# EAGLE design electromyography_3_channels (EAGLE 8.4.1)
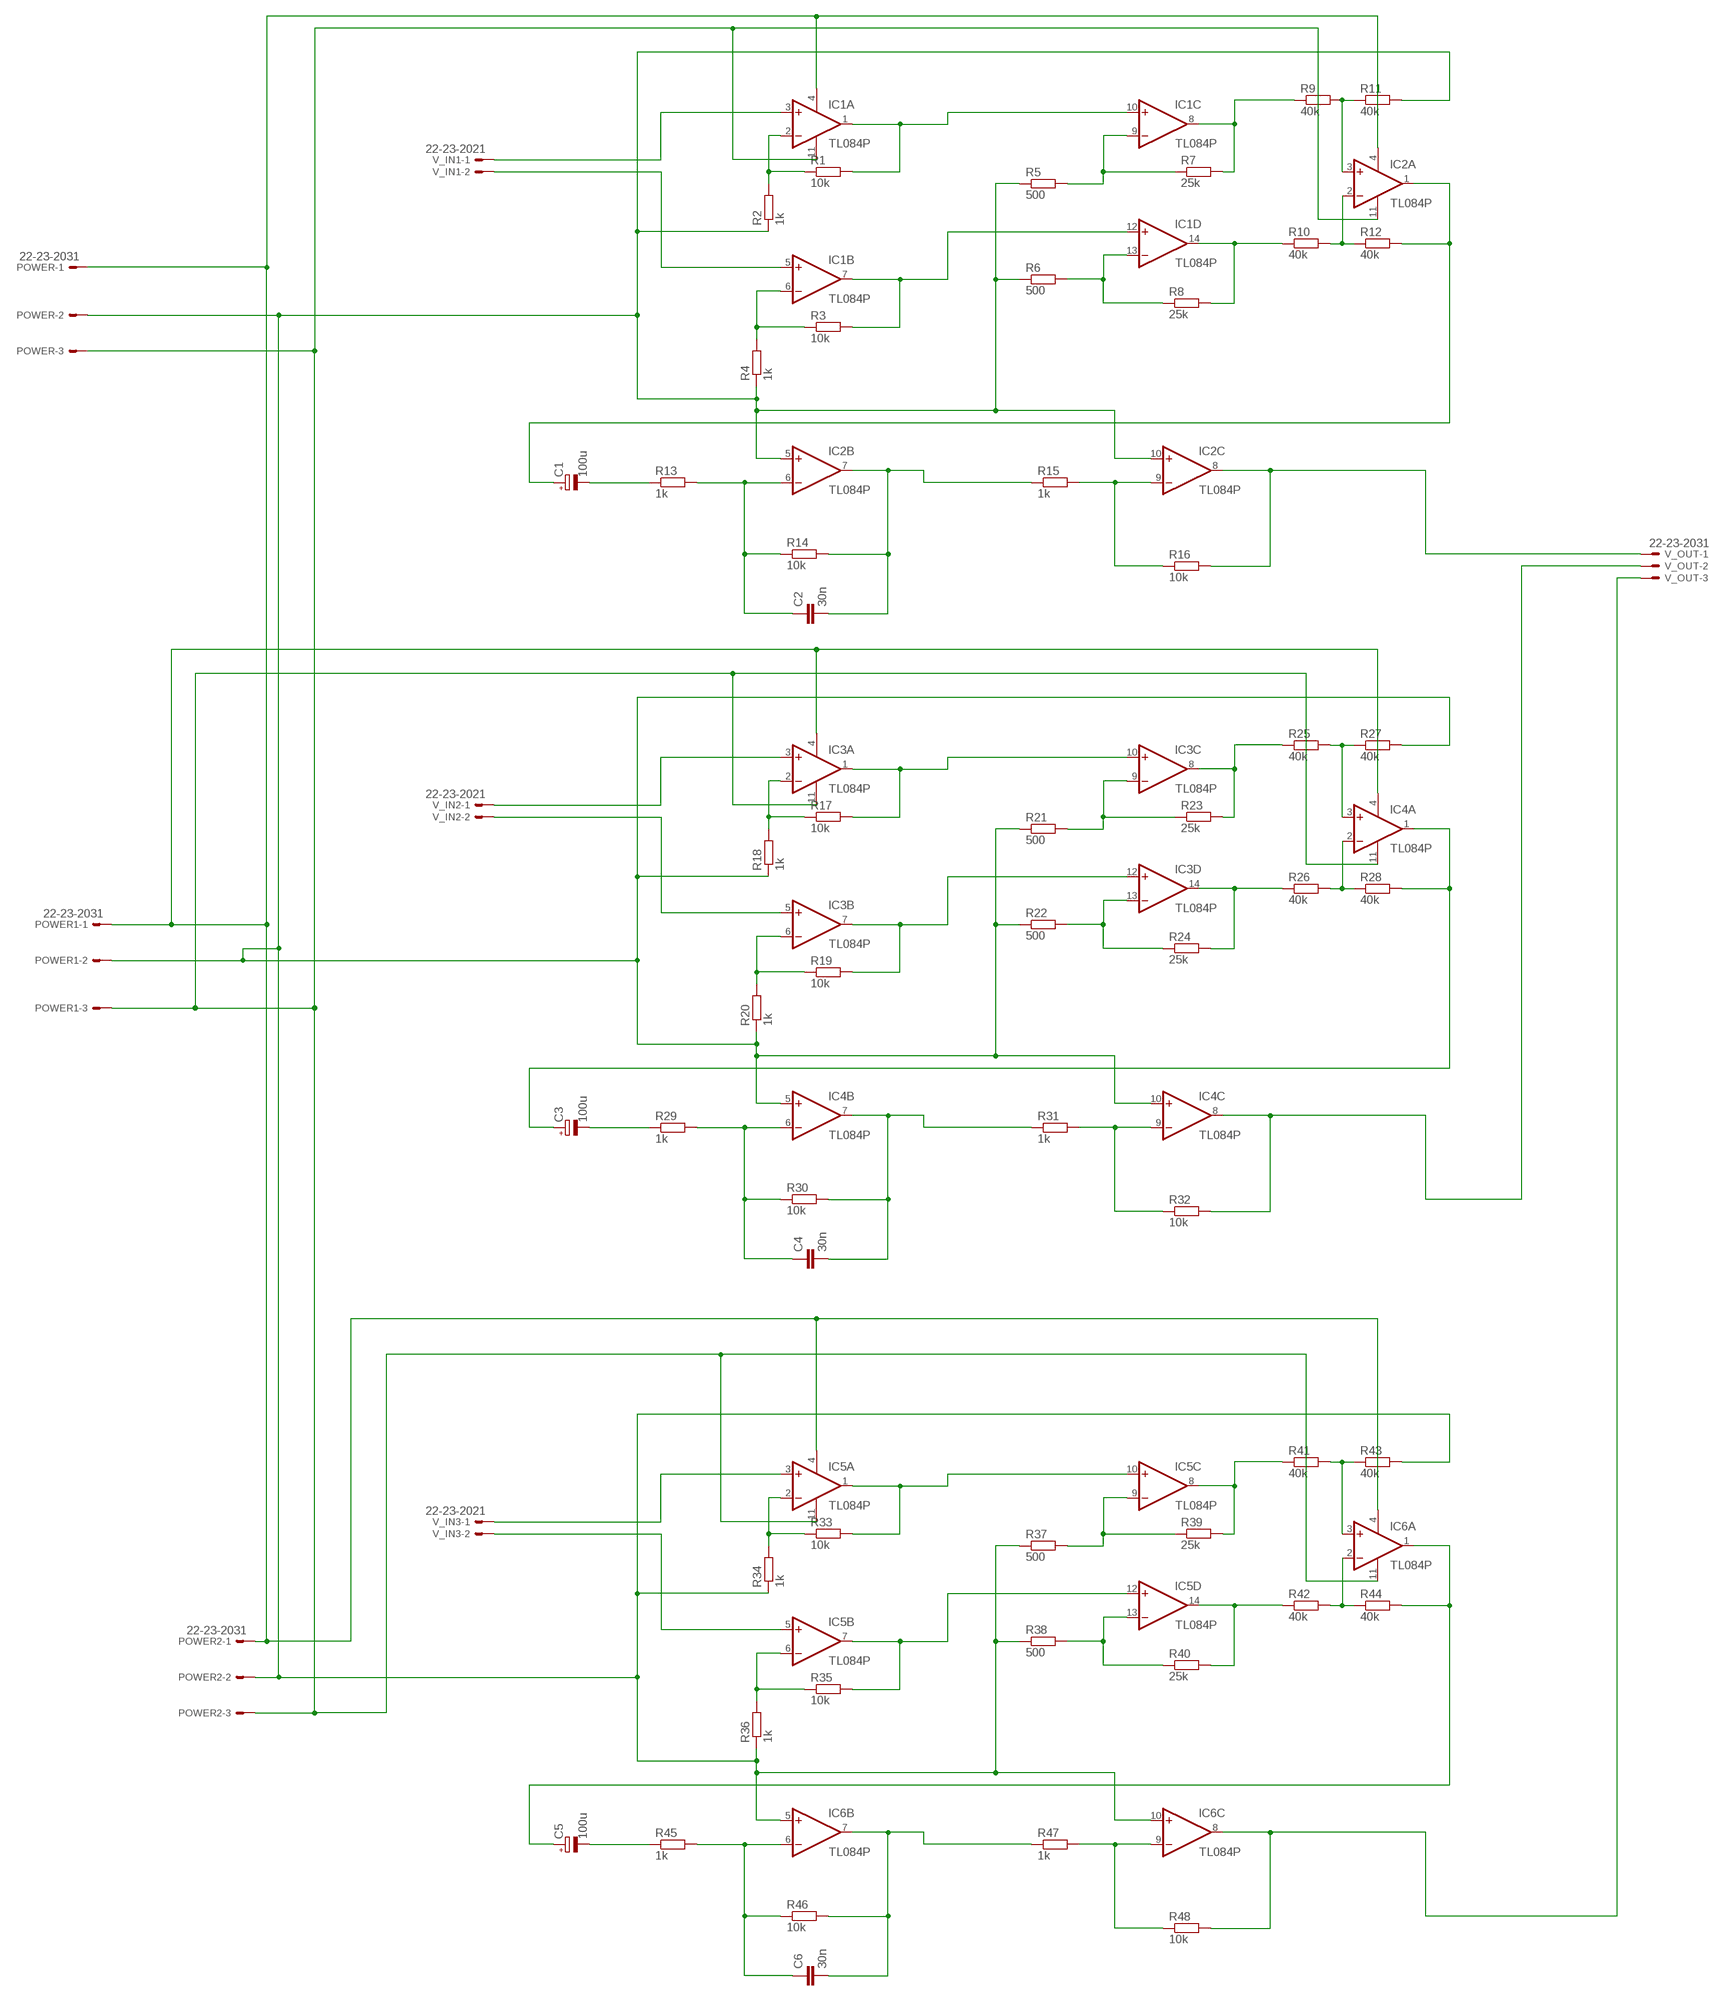
[diagram p0: schematic, sheet 1]

## Parts
C1  100u  CPOL-EUE3.5-8  [E3,5-8]
C2  30n  C-EU050-024X044  [C050-024X044]
C3  100u  CPOL-EUE3.5-8  [E3,5-8]
C4  30n  C-EU050-024X044  [C050-024X044]
C5  100u  CPOL-EUE3.5-8  [E3,5-8]
C6  30n  C-EU050-024X044  [C050-024X044]
IC1  TL084P  [DIL14]
IC2  TL084P  [DIL14]
IC3  TL084P  [DIL14]
IC4  TL084P  [DIL14]
IC5  TL084P  [DIL14]
IC6  TL084P  [DIL14]
POWER  22-23-2031  [22-23-2031]
POWER1  22-23-2031  [22-23-2031]
POWER2  22-23-2031  [22-23-2031]
R1  10k  R-EU_0207/10  [0207/10]
R2  1k  R-EU_0207/10  [0207/10]
R3  10k  R-EU_0207/10  [0207/10]
R4  1k  R-EU_0207/10  [0207/10]
R5  500  R-EU_0207/10  [0207/10]
R6  500  R-EU_0207/10  [0207/10]
R7  25k  R-EU_0207/10  [0207/10]
R8  25k  R-EU_0207/10  [0207/10]
R9  40k  R-EU_0207/10  [0207/10]
R10  40k  R-EU_0207/10  [0207/10]
R11  40k  R-EU_0207/10  [0207/10]
R12  40k  R-EU_0207/10  [0207/10]
R13  1k  R-EU_0207/10  [0207/10]
R14  10k  R-EU_0207/10  [0207/10]
R15  1k  R-EU_0207/10  [0207/10]
R16  10k  R-EU_0207/10  [0207/10]
R17  10k  R-EU_0207/10  [0207/10]
R18  1k  R-EU_0207/10  [0207/10]
R19  10k  R-EU_0207/10  [0207/10]
R20  1k  R-EU_0207/10  [0207/10]
R21  500  R-EU_0207/10  [0207/10]
R22  500  R-EU_0207/10  [0207/10]
R23  25k  R-EU_0207/10  [0207/10]
R24  25k  R-EU_0207/10  [0207/10]
R25  40k  R-EU_0207/10  [0207/10]
R26  40k  R-EU_0207/10  [0207/10]
R27  40k  R-EU_0207/10  [0207/10]
R28  40k  R-EU_0207/10  [0207/10]
R29  1k  R-EU_0207/10  [0207/10]
R30  10k  R-EU_0207/10  [0207/10]
R31  1k  R-EU_0207/10  [0207/10]
R32  10k  R-EU_0207/10  [0207/10]
R33  10k  R-EU_0207/10  [0207/10]
R34  1k  R-EU_0207/10  [0207/10]
R35  10k  R-EU_0207/10  [0207/10]
R36  1k  R-EU_0207/10  [0207/10]
R37  500  R-EU_0207/10  [0207/10]
R38  500  R-EU_0207/10  [0207/10]
R39  25k  R-EU_0207/10  [0207/10]
R40  25k  R-EU_0207/10  [0207/10]
R41  40k  R-EU_0207/10  [0207/10]
R42  40k  R-EU_0207/10  [0207/10]
R43  40k  R-EU_0207/10  [0207/10]
R44  40k  R-EU_0207/10  [0207/10]
R45  1k  R-EU_0207/10  [0207/10]
R46  10k  R-EU_0207/10  [0207/10]
R47  1k  R-EU_0207/10  [0207/10]
R48  10k  R-EU_0207/10  [0207/10]
V_IN1  22-23-2021  [22-23-2021]
V_IN2  22-23-2021  [22-23-2021]
V_IN3  22-23-2021  [22-23-2021]
V_OUT  22-23-2031  [22-23-2031]

## Nets
N$1: IC1.2(A:-IN) R1.1 R2.2
N$2: IC1.1(A:OUT) IC1.10(C:+IN) R1.2
N$3: IC1.9(C:-IN) R5.2 R7.1
N$4: IC1.6(B:-IN) R3.1 R4.2
N$5: IC1.7(B:OUT) IC1.12(D:+IN) R3.2
N$6: IC1.13(D:-IN) R6.2 R8.1
N$7: IC1.14(D:OUT) R8.2 R10.1
N$8: IC1.8(C:OUT) R7.2 R9.1
N$9: IC2.2(A:-IN) R10.2 R12.1
N$10: IC2.3(A:+IN) R9.2 R11.1
N$11: C1.+ IC2.1(A:OUT) R12.2
N$12: C1.- R13.1
N$13: C2.1 IC2.6(B:-IN) R13.2 R14.1
N$14: C2.2 IC2.7(B:OUT) R14.2 R15.1
N$15: IC2.9(C:-IN) R15.2 R16.1
N$16: IC2.8(C:OUT) R16.2 V_OUT.1
N$17: IC1.3(A:+IN) V_IN1.1
N$19: IC1.5(B:+IN) V_IN1.2
N$21 [power]: IC1.4(P:V+) IC2.4(P:V+) IC3.4(P:V+) IC4.4(P:V+) IC5.4(P:V+) IC6.4(P:V+) POWER1.1 POWER2.1 POWER.1
N$25: IC3.2(A:-IN) R17.1 R18.2
N$26: IC3.1(A:OUT) IC3.10(C:+IN) R17.2
N$27: IC3.9(C:-IN) R21.2 R23.1
N$28: IC3.6(B:-IN) R19.1 R20.2
N$29: IC3.7(B:OUT) IC3.12(D:+IN) R19.2
N$30: IC3.13(D:-IN) R22.2 R24.1
N$31: IC3.14(D:OUT) R24.2 R26.1
N$32: IC3.8(C:OUT) R23.2 R25.1
N$33: IC4.2(A:-IN) R26.2 R28.1
N$34: IC4.3(A:+IN) R25.2 R27.1
N$35: C3.+ IC4.1(A:OUT) R28.2
N$36: C3.- R29.1
N$37: C4.1 IC4.6(B:-IN) R29.2 R30.1
N$38: C4.2 IC4.7(B:OUT) R30.2 R31.1
N$39: IC4.9(C:-IN) R31.2 R32.1
N$40: IC4.8(C:OUT) R32.2 V_OUT.2
N$41 [ground]: IC2.5(B:+IN) IC2.10(C:+IN) IC4.5(B:+IN) IC4.10(C:+IN) IC6.5(B:+IN) IC6.10(C:+IN) POWER1.2 POWER2.2 POWER.2 R2.1 R4.1 R5.1 R6.1 R11.2 R18.1 R20.1 R21.1 R22.1 R27.2 R34.1 R36.1 R37.1 R38.1 R43.2
N$42: IC3.3(A:+IN) V_IN2.1
N$43: IC3.5(B:+IN) V_IN2.2
N$44: IC5.2(A:-IN) R33.1 R34.2
N$45: IC5.1(A:OUT) IC5.10(C:+IN) R33.2
N$46: IC5.9(C:-IN) R37.2 R39.1
N$47: IC5.6(B:-IN) R35.1 R36.2
N$48: IC5.7(B:OUT) IC5.12(D:+IN) R35.2
N$49: IC5.13(D:-IN) R38.2 R40.1
N$50: IC5.14(D:OUT) R40.2 R42.1
N$51: IC5.8(C:OUT) R39.2 R41.1
N$52: IC6.2(A:-IN) R42.2 R44.1
N$53: IC6.3(A:+IN) R41.2 R43.1
N$54: C5.+ IC6.1(A:OUT) R44.2
N$55: C5.- R45.1
N$56: C6.1 IC6.6(B:-IN) R45.2 R46.1
N$57: C6.2 IC6.7(B:OUT) R46.2 R47.1
N$58: IC6.9(C:-IN) R47.2 R48.1
N$59: IC6.8(C:OUT) R48.2 V_OUT.3
N$60 [power]: IC1.11(P:V-) IC2.11(P:V-) IC3.11(P:V-) IC4.11(P:V-) IC5.11(P:V-) IC6.11(P:V-) POWER1.3 POWER2.3 POWER.3
N$61: IC5.3(A:+IN) V_IN3.1
N$62: IC5.5(B:+IN) V_IN3.2
Unconnected: IC2.12(D:+IN) IC2.13(D:-IN) IC2.14(D:OUT) IC4.12(D:+IN) IC4.13(D:-IN) IC4.14(D:OUT) IC6.12(D:+IN) IC6.13(D:-IN) IC6.14(D:OUT)

## Library data of the parts
C1 C3 C5 = rcl:CPOL-EU: POLARIZED CAPACITOR, European symbol
C2 C4 C6 = rcl:C-EU: CAPACITOR, European symbol
IC1-IC6 = linear2:TL084: OP AMP
POWER POWER1 POWER2 V_OUT = con-molex:22-23-2031: .100" (2.54mm) Center Header - 3 Pin; MF: MOLEX; MPN: 22-23-2031; OC_FARNELL: 1462950; OC_NEWARK: 30C0862
R1-R48 = resistor:R-EU_: RESISTOR, European symbol
V_IN1-V_IN3 = con-molex:22-23-2021: .100" (2.54mm) Center Header - 2 Pin; MF: MOLEX; MPN: 22-23-2021; OC_FARNELL: 1462926; OC_NEWARK: 25C3832

## Net classes
0 default: width 0.406 mm, drill 0.254 mm, clearance 0.254 mm
1 ground: width 0.61 mm, drill 0.254 mm, clearance 0.254 mm
2 power: width 0.61 mm, drill 0.254 mm, clearance 0.254 mm

## Board
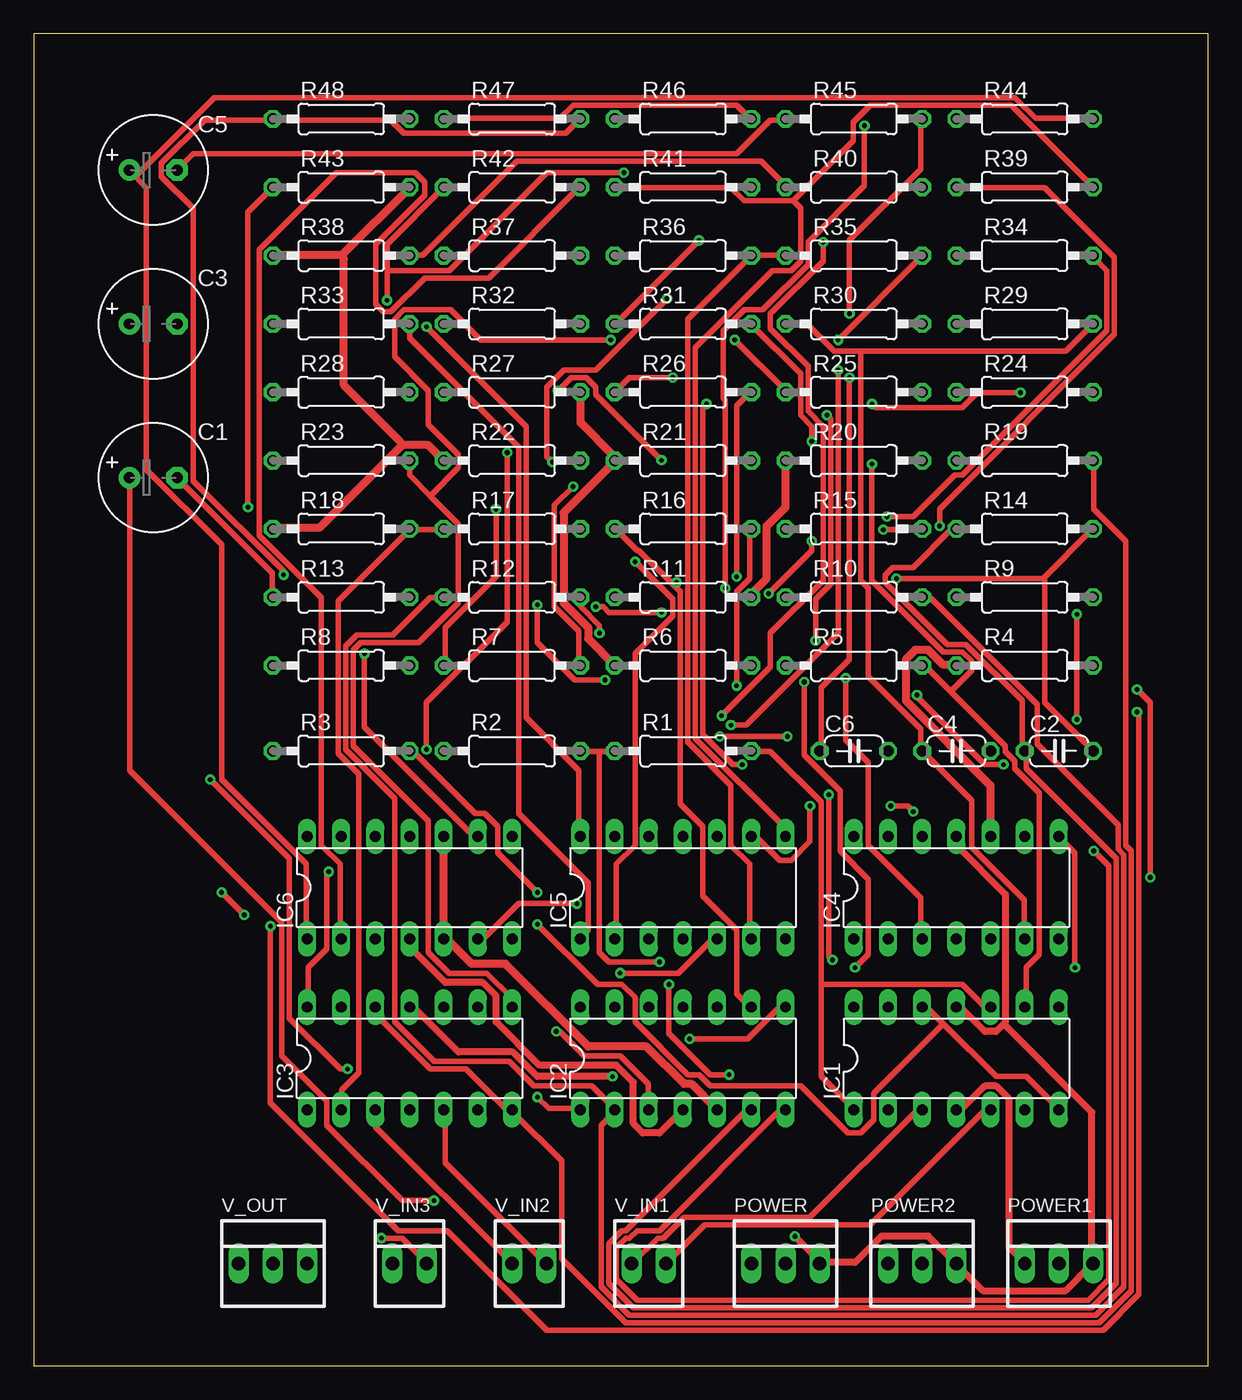
[diagram p1: board, top side]
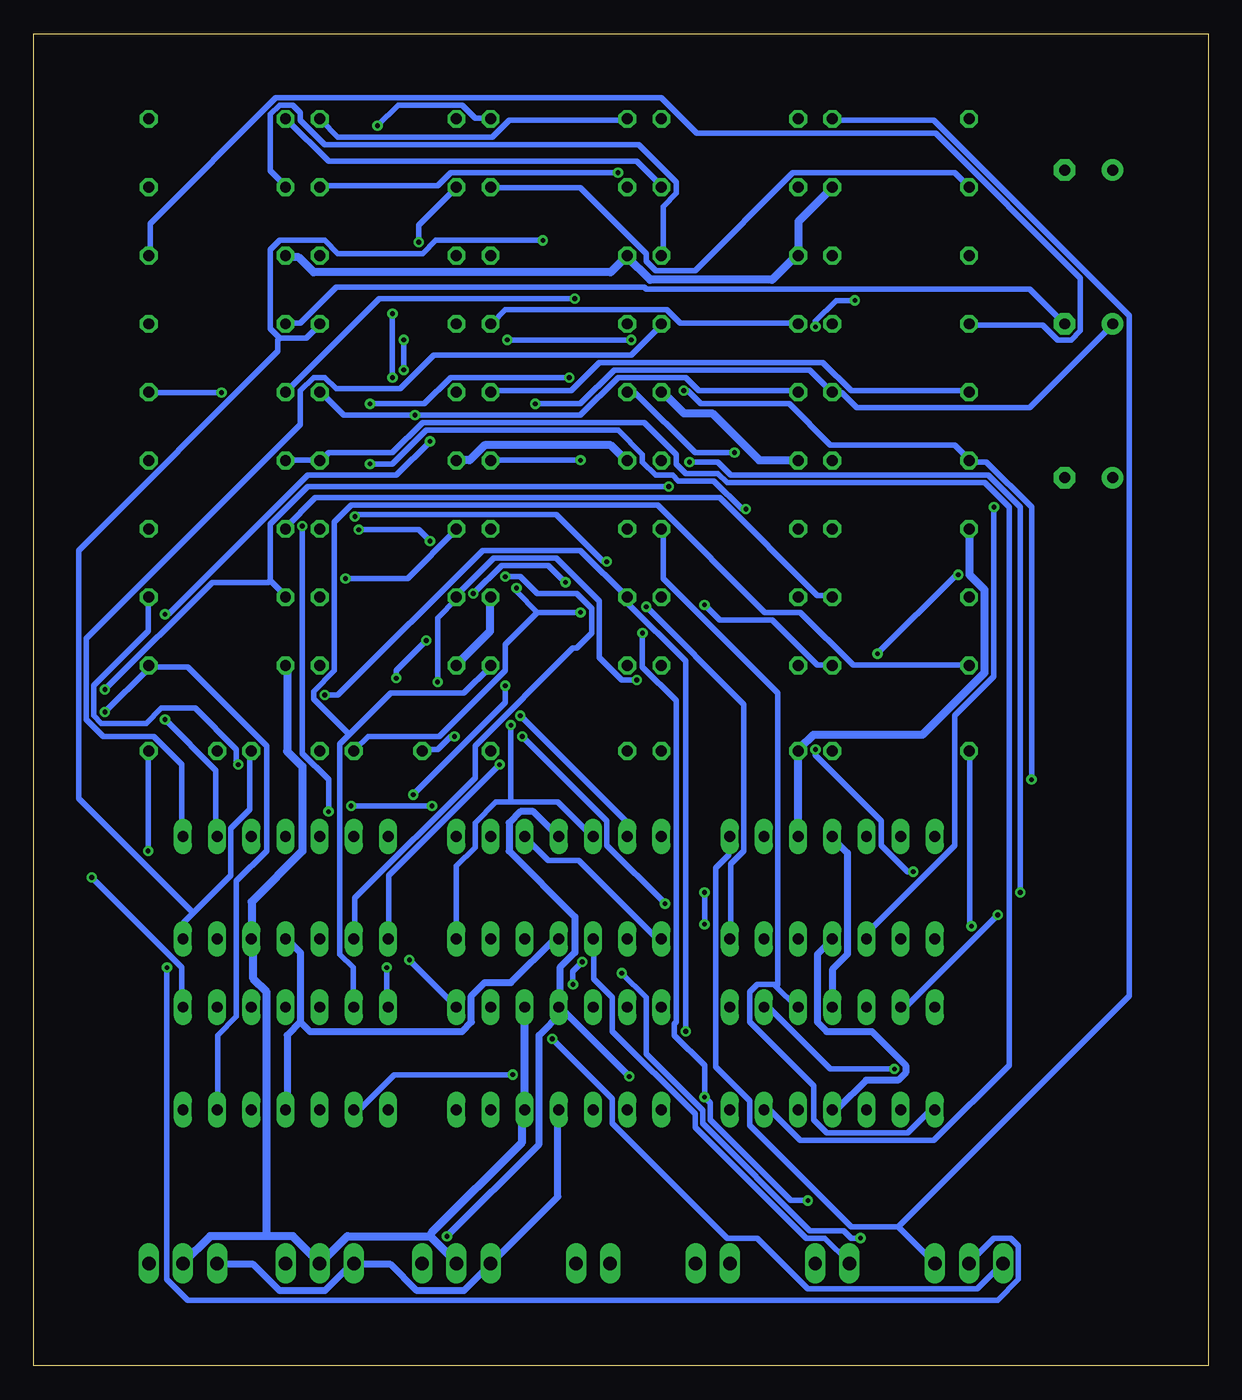
[diagram p2: board, bottom side, seen from below]

Size 87.3 x 99.05 mm. Coordinates in mm from the lower left corner, seen from the top.
Outline: 0,0 87.3,0 87.3,99.05 0,99.05 0,0
Copper layers (1*16): Top 0.035mm / dielectric 1.5mm / Bottom 0.035mm
Design rules "default": minimum track width 6mil, minimum drill 0.35mm, track to track 6mil, track to pad 6mil, pad to pad 6mil, via to via 6mil, smd to smd 6mil, copper to edge 40mil, drill to drill 6mil, minimum pad ring 10mil, minimum via ring 8mil, stop-mask expansion 4mil, vias tented up to drill 0mil, thermal gap 10mil

### Footprints (pad centres in the part's own frame; a part is rotated, then mirrored left to right if it is on the bottom)
E3,5-8 = drill 0.813 pad 1.6: + -1.778,0 | drill 0.813 pad 1.6 octagon: - 1.778,0
C050-024X044 = drill 0.813 octagon: 1 -2.54,0; 2 2.54,0
DIL14 = drill 0.813 long: 1 -7.62,-3.81; 2 -5.08,-3.81; 3 -2.54,-3.81; 4 0,-3.81; 5 2.54,-3.81; 6 5.08,-3.81; 7 7.62,-3.81; 8 7.62,3.81; 9 5.08,3.81; 10 2.54,3.81; 11 0,3.81; 12 -2.54,3.81; 13 -5.08,3.81; 14 -7.62,3.81
22-23-2031 = drill 1 long: 1 -2.54,0; 2 0,0; 3 2.54,0
0207/10 = drill 0.813 octagon: 1 -5.08,0; 2 5.08,0
22-23-2021 = drill 1 long: 1 -1.27,0; 2 1.27,0

### Placement (x,y rotation side)
C1  8.89,66.04 0 top
C2  76.2,45.72 0 top
C3  8.89,77.47 0 top
C4  68.58,45.72 0 top
C5  8.89,88.9 0 top
C6  60.96,45.72 0 top
IC1  68.58,22.86 0 top
IC2  48.26,22.86 0 top
IC3  27.94,22.86 0 top
IC4  68.58,35.56 0 top
IC5  48.26,35.56 0 top
IC6  27.94,35.56 0 top
POWER  55.88,7.62 0 top
POWER1  76.2,7.62 0 top
POWER2  66.04,7.62 0 top
R1  48.26,45.72 0 top
R2  35.56,45.72 0 top
R3  22.86,45.72 0 top
R4  73.66,52.07 0 top
R5  60.96,52.07 0 top
R6  48.26,52.07 0 top
R7  35.56,52.07 0 top
R8  22.86,52.07 0 top
R9  73.66,57.15 0 top
R10  60.96,57.15 0 top
R11  48.26,57.15 0 top
R12  35.56,57.15 0 top
R13  22.86,57.15 0 top
R14  73.66,62.23 0 top
R15  60.96,62.23 0 top
R16  48.26,62.23 0 top
R17  35.56,62.23 0 top
R18  22.86,62.23 0 top
R19  73.66,67.31 0 top
R20  60.96,67.31 0 top
R21  48.26,67.31 0 top
R22  35.56,67.31 0 top
R23  22.86,67.31 0 top
R24  73.66,72.39 0 top
R25  60.96,72.39 0 top
R26  48.26,72.39 0 top
R27  35.56,72.39 0 top
R28  22.86,72.39 0 top
R29  73.66,77.47 0 top
R30  60.96,77.47 0 top
R31  48.26,77.47 0 top
R32  35.56,77.47 0 top
R33  22.86,77.47 0 top
R34  73.66,82.55 0 top
R35  60.96,82.55 0 top
R36  48.26,82.55 0 top
R37  35.56,82.55 0 top
R38  22.86,82.55 0 top
R39  73.66,87.63 0 top
R40  60.96,87.63 0 top
R41  48.26,87.63 0 top
R42  35.56,87.63 0 top
R43  22.86,87.63 0 top
R44  73.66,92.71 0 top
R45  60.96,92.71 0 top
R46  48.26,92.71 0 top
R47  35.56,92.71 0 top
R48  22.86,92.71 0 top
V_IN1  45.72,7.62 0 top
V_IN2  36.83,7.62 0 top
V_IN3  27.94,7.62 0 top
V_OUT  17.78,7.62 0 top

### Tracks (layer width: path | path; a pad name or v marks a point on that pad's centre or on a via)
N$1  (via drill 0.35)
  Top 0.406: 42.05,45.68 43.17,45.68 R1.1 | 42.05,45.68 40.65,45.68 R2.2 | v51.69,21.65 50.29,21.65 47.22,24.73 v47.22,28.36 | v46.52,30.04 42.75,30.04 42.05,30.73 42.05,45.68
  Bottom 0.406: v51.69,21.65 60.49,21.65 63,19.14 63.42,19.14 IC1.2 | v47.22,28.36 47.22,29.34 v46.52,30.04
N$2
  Top 0.406: 58.53,28.36 58.53,21.51 60.91,19.14 IC1.1 | 58.53,28.36 58.53,41.91 54.76,45.68 53.36,45.68 R1.2 | 58.53,28.36 69.01,28.36 70.69,26.68 71.11,26.68 IC1.10
N$3  (via drill 0.35)
  Top 0.406: 68.17,50.15 66.36,51.97 66.08,51.97 R5.2 | 68.17,50.15 72.22,46.1 72.22,45.68 72.92,44.98 72.92,44.43 74.74,42.61 74.74,30.59 73.76,29.62 73.76,26.68 IC1.9 | v34.37,63.7 34.37,58.67 30.59,54.9 30.59,52.11 R7.1 | v62.31,67.06 62.31,58.39 67.61,53.09 69.01,53.09 69.71,52.39 69.71,51.69 68.17,50.15
  Bottom 0.406: v34.37,63.7 34.65,63.7 36.74,65.8 39.39,65.8 39.81,66.22 41.07,66.22 42.05,67.2 42.05,67.75 43.87,69.57 58.11,69.57 60.63,67.06 v62.31,67.06
N$4  (via drill 0.35)
  Top 0.406: v17.6,32.69 17.6,19.56 27.1,10.06 30.73,10.06 38.14,2.65 79.49,2.65 82.14,5.31 82.14,48.48 v82,48.62
  Bottom 0.406: IC1.6 73.62,19.14 73.62,24.59 72.22,25.98 72.22,36.04 69.99,38.28 69.99,46.1 75.86,51.97 78.65,51.97 R4.2 78.79,51.83 v82,48.62 | v17.6,32.69 17.74,32.83 17.74,45.68 R3.1
N$5  (via drill 0.35)
  Top 0.406: 67.61,25.43 71.53,21.51 73.76,21.51 76.14,19.14 IC1.7 | 67.61,25.43 66.5,26.54 66.08,26.54 IC1.12 | v37.44,35.2 34.51,38.14 34.51,40.09 33.53,41.07 32.83,41.07 28.22,45.68 27.94,45.68 R3.2 | v37.44,32.83 41.91,28.36 43.73,28.36 44.7,27.38 44.7,25.56 48.62,21.65 49.45,21.65 50.29,20.81 57,20.81 60.49,17.32 61.47,17.32 62.45,18.3 62.45,20.26 67.61,25.43
  Bottom 0.406: v37.44,32.83 v37.44,35.2
N$6
  Bottom 0.406: 63.84,46.94 60.77,50.01 55.32,50.01 53.36,51.97 R6.2 | 63.84,46.94 64.54,46.24 64.54,30.59 63.56,29.62 63.56,26.68 IC1.13 | 63.84,46.94 66.5,49.59 66.5,50.15 64.96,51.69 64.96,62.72 63.7,63.98 40.93,63.98 32.97,56.02 30.31,56.02 26.4,52.11 17.88,52.11 R8.1
N$7  (via drill 0.35)
  Top 0.406: v37.44,56.58 37.44,53.78 40.23,50.99 v42.47,50.99 | v61.05,29.62 62.03,30.59 62.03,36.18 59.93,38.28 59.93,42.75 57.28,45.4 v57.28,50.85
  Bottom 0.406: v37.44,56.58 36.32,55.46 32.41,55.46 29.06,52.11 27.94,52.11 R8.2 | v42.47,50.99 43.59,50.99 45.26,52.67 45.26,56.86 48.48,60.07 53.09,60.07 55.88,57.28 R10.1 55.88,57 57.28,55.6 v57.28,50.85 | v61.05,29.62 61.05,26.68 IC1.14
N$8  (via drill 0.35)
  Top 0.406: v40.09,65.38 38.7,63.98 38.7,56.44 40.51,54.62 40.51,52.11 R7.2 | v82.98,36.32 82.98,49.31 v82,50.29
  Bottom 0.406: v40.09,65.38 66.92,65.38 69.71,62.59 69.71,58.39 | 69.71,58.39 68.59,57.28 R9.1 | v82.98,36.32 76.28,29.62 76.28,26.68 IC1.8 | v82,50.29 74.04,58.25 69.85,58.25 69.71,58.39
N$9
  Top 0.406: R12.1 30.45,57.14 29.48,57.14 26.68,54.34 24.03,54.34 23.19,53.5 23.19,45.82 26.82,42.19 26.82,25.56 29.76,22.63 35.34,22.63 37.16,20.81 41.49,20.81 43.17,19.14 IC2.2 43.17,18.86 42.19,17.88 42.19,5.87 44.28,3.77 78.93,3.77 81.03,5.87 81.03,38 80.61,38.42 80.61,40.23 74.6,46.24 74.6,49.17 66.64,57.14 66.08,57.14 R10.2
N$10  (via drill 0.35)
  Top 0.406: v38.84,24.87 39.12,24.87 40.93,23.05 43.59,23.05 45.68,20.95 45.68,19.14 IC2.3 | v72.08,44.7 70.69,44.7 65.66,49.73 v65.66,49.87
  Bottom 0.406: v38.84,24.87 38.84,52.39 43.17,56.72 43.17,57.14 R11.1 46.66,60.63 53.92,60.63 64.68,49.87 v65.66,49.87 | v72.08,44.7 72.22,44.84 72.22,45.82 75.3,48.9 77.81,48.9 78.93,47.78 82.28,47.78 82.84,48.34 82.84,50.57 78.79,54.62 78.79,57.14 R9.2
N$11  (via drill 0.35)
  Top 0.406: v37.44,19.98 38.28,19.14 40.51,19.14 IC2.1 | v42.05,54.48 42.05,55.04 40.65,56.44 40.65,57.14 R12.2 | v29.76,12.29 27.38,12.29 21.79,17.88 21.79,19.7 18.44,23.05 18.44,32.97 7.12,44.29 7.12,65.94 C1.+
  Bottom 0.406: v42.05,54.48 42.05,51.97 39.53,49.45 39.53,25.56 39.67,25.43 39.67,24.59 37.44,22.35 v37.44,19.98 37.02,19.56 37.02,18.3 31.01,12.29 v29.76,12.29
N$12
  Top 0.406: R13.1 17.74,57.28 17.74,58.95 10.76,65.94 C1.-
N$13
  Top 0.406: IC2.6 53.23,19 52.95,19 44,10.06 43.73,10.06 42.75,9.08 42.75,6.15 44.56,4.33 78.65,4.33 80.47,6.15 80.47,37.72 73.76,44.43 73.76,45.68 C2.1 73.48,45.82 73.48,49.45 69.29,53.64 67.89,53.64 63.28,58.25 63.28,58.81 63.84,59.37 65.38,59.37 68.17,62.17 68.45,62.17 R14.1
  Bottom 0.406: R13.2 27.94,57.28 29.06,57.28 36.32,64.54 66.36,64.54 68.59,62.31 R14.1
N$14  (via drill 0.35)
  Top 0.406: 75.02,58.53 v64.12,58.53 | 75.02,58.53 78.65,62.17 R14.2 | v78.79,38.28 79.91,37.16 79.91,6.43 78.37,4.89 44.84,4.89 43.31,6.43 43.31,8.8 44,9.5 44.28,9.5 44.84,10.06 46.52,10.06 55.46,19 55.88,19 IC2.7 | 75.02,58.53 75.16,58.39 75.16,49.31 78.65,45.82 C2.2
  Bottom 0.406: v64.12,58.53 59.51,58.53 55.88,62.17 R15.1 | v78.79,38.28 78.79,45.68 C2.2
N$15  (via drill 0.35)
  Top 0.406: 47.5,58.11 48.06,57.56 48.06,41.77 49.73,40.09 49.73,34.93 52.25,32.41 52.25,27.66 53.23,26.68 IC2.9 | 47.5,58.11 44.98,60.63 44.84,60.63 43.31,62.17 R16.1 | v63.14,62.17 65.94,62.17 R15.2 | v57.84,61.33 57.84,60.63 v54.62,57.42 | v47.78,58.25 47.64,58.25 47.5,58.11
  Bottom 0.406: v63.14,62.17 58.67,62.17 v57.84,61.33 | v54.62,57.42 52.53,59.51 49.03,59.51 v47.78,58.25
N$16  (via drill 0.35)
  Top 0.406: v48.75,24.31 53.09,24.31 55.32,26.54 55.88,26.54 IC2.8 | v52.25,50.57 52.25,57.56 53.23,58.53 53.23,62.17 R16.2 | v59.09,42.47 59.09,30.45 v59.37,30.18
  Bottom 0.406: v48.75,24.31 44.28,19.84 44.28,18.02 35.76,9.5 33.53,9.5 29.76,5.73 17.18,5.73 15.37,7.54 V_OUT.1 | v52.25,50.57 52.25,49.31 v59.09,42.47 | v59.37,30.18 55.88,26.68 IC2.8
N$17
  Top 0.406: IC1.3 65.94,19 65.66,19 57.7,11.04 48.34,11.04 46.8,9.5 46.38,9.5 44.56,7.68 V_IN1.1
N$19
  Top 0.406: IC1.5 71.11,19 70.69,19 62.17,10.48 49.87,10.48 47.08,7.68 V_IN1.2
N$21
  Top 0.508: IC6.4 27.94,31.15 30.59,28.5 33.39,28.5 34.37,27.52 34.37,25.56 37.58,22.35 43.31,22.35 44.56,21.09 44.56,18.02 45.26,17.32 46.52,17.32 48.2,19 IC2.4 | IC1.4 68.59,19.14 69.01,19.14 70.69,20.81 71.53,20.81 72.5,19.84 72.5,8.8 73.62,7.68 POWER1.1
  Bottom 0.508: 67.47,25.56 68.45,24.59 68.45,19.14 IC1.4 | 67.47,25.56 67.47,30.73 68.45,31.71 IC4.4 | 67.47,25.56 66.78,24.87 55.46,24.87 54.76,25.56 54.76,27.52 53.78,28.5 51.83,28.5 48.62,31.71 48.34,31.71 IC5.4 | IC3.4 27.94,19.14 27.52,19.14 25.42,21.23 23.05,21.23 22.49,21.79 22.49,22.35 25.01,24.87 28.36,24.87 29.06,25.56 29.06,30.59 27.94,31.71 IC6.4 | IC2.4 48.34,19 48.34,12.57 53.23,7.68 POWER.1 53.5,7.4 55.32,5.59 58.81,5.59 60.77,7.54 63.42,7.54 POWER2.1 63.7,7.54 65.66,5.59 69.01,5.59 70.97,7.54 73.62,7.54 POWER1.1
N$25
  Top 0.406: IC3.2 22.91,19.14 22.91,20.54 24.17,21.79 24.17,44.01 22.63,45.54 22.63,56.86 27.94,62.17 R18.2 28.08,62.17 30.45,62.17 R17.1
N$26
  Bottom 0.406: 32.13,28.22 30.59,26.68 IC3.10 | 32.13,28.22 32.27,28.36 33.53,28.36 34.09,27.8 34.09,25.56 29.34,20.81 29.34,18.3 28.36,17.32 22.35,17.32 20.68,19 20.4,19 IC3.1 | R17.2 40.51,62.17 40.51,58.53 31.99,50.01 31.99,28.36 32.13,28.22
N$27  (via drill 0.35)
  Top 0.406: v23.33,22.07 22.77,22.07 19,25.84 19,37.72 v13.13,43.59 | v46.66,67.34 41.77,72.22 41.77,72.78 41.07,73.48 39.95,73.48 v38.98,72.5
  Bottom 0.406: v23.33,22.07 28.08,22.07 32.55,26.54 32.97,26.54 IC3.9 | v13.13,43.59 13.13,63.84 16.48,67.2 17.74,67.2 R23.1 17.88,67.47 18.86,68.45 28.08,68.45 31.15,71.53 37.72,71.53 38.7,72.5 v38.98,72.5 | v46.66,67.34 53.23,67.34 R21.2
N$28
  Bottom 0.406: IC3.6 32.97,19 32.55,19 30.31,16.76 20.4,16.76 14.81,22.35 14.81,63.84 16.62,65.66 35.76,65.66 36.46,66.36 38.84,66.36 39.53,67.06 39.53,67.75 41.91,70.13 58.39,70.13 60.63,67.89 65.38,67.89 65.94,67.34 R20.2 66.22,67.34 68.45,67.34 R19.1
N$29
  Top 0.406: IC3.12 25.42,26.54 25.42,26.12 29.48,22.07 32.13,22.07 35.06,19.14 35.48,19.14 IC3.7 35.62,18.86 39.26,15.23 39.26,7.96 44,3.21 79.21,3.21 81.58,5.59 81.58,38.28 81.17,38.7 81.17,61.33 78.79,63.7 78.79,67.2 R19.2
N$30  (via drill 0.35)
  Top 0.406: v13.97,35.2 v15.65,33.53 | R22.2 40.51,67.2 v38.56,67.2 38.14,67.61 38.14,72.78 39.39,74.04 41.77,74.04 v47.08,79.35
  Bottom 0.406: v15.65,33.53 22.49,26.68 22.77,26.68 IC3.13 | v13.97,35.2 13.97,63.84 16.34,66.22 35.48,66.22 36.46,67.2 v38.56,67.2 | v47.08,79.35 61.61,79.35 68.45,72.5 R24.1
N$31  (via drill 0.35)
  Top 0.406: v21.93,36.74 21.79,36.6 21.79,31.01 20.4,29.62 20.4,26.68 IC3.14 | v29.2,45.82 29.2,49.31 35.2,55.32 v35.2,67.89 | v73.34,72.36 70.13,72.36 69.01,71.25 62.59,71.25 v62.31,71.53 | v47.5,73.48 44.28,73.48 43.31,72.5 R26.1
  Bottom 0.406: v21.93,36.74 22.35,36.74 24.31,38.7 24.31,40.51 29.2,45.4 v29.2,45.82 | v35.2,67.89 38.14,67.89 42.61,72.36 43.17,72.36 R26.1 | v73.34,72.36 78.65,72.36 R24.2 | v62.31,71.53 58.25,71.53 56.3,73.48 v47.5,73.48
N$32  (via drill 0.35)
  Top 0.406: R23.2 27.94,66.22 29.48,64.68 | 29.48,64.68 31.57,62.59 31.57,56.72 28.64,53.78 24.31,53.78 23.75,53.23 23.75,46.1 29.34,40.51 29.34,30.73 30.87,29.2 33.67,29.2 35.48,27.38 35.48,26.68 IC3.8 | v52.11,76.28 55.88,72.5 R25.1 | v42.89,76.28 33.25,76.28 31.01,78.51 27.52,78.51 26.82,77.81 26.82,75.02 29.34,72.5 29.34,69.99 31.57,67.75 31.57,66.78 29.48,64.68
  Bottom 0.406: v42.89,76.28 v52.11,76.28
N$33  (via drill 0.35)
  Top 0.406: v52.25,58.67 52.25,71.39 53.23,72.36 R26.2
  Bottom 0.406: v52.25,58.67 51.13,58.67 49.87,57.42 46.94,57.42 45.82,56.3 45.82,54.48 46.94,53.36 47.22,53.36 54.48,46.1 54.48,43.73 63.42,34.79 63.42,31.85 IC4.2 | R28.1 17.88,72.5 26.54,72.5 28.64,74.6 45.26,74.6 47.36,72.5 53.23,72.5 R26.2
N$34  (via drill 0.35)
  Top 0.406: v60.35,51.13 60.35,46.52 62.03,44.84 62.03,38.7 65.94,34.79 65.94,31.85 IC4.3 | v58.11,53.92 58.11,57 59.23,58.11 59.23,70.41 v58.95,70.69
  Bottom 0.406: v60.35,51.13 60.35,51.69 v58.11,53.92 | R25.2 65.94,72.36 64.26,70.69 v58.95,70.69 46.66,70.69 43.87,73.48 38.84,73.48 37.86,72.5 30.59,72.5 R27.1
N$35  (via drill 0.35)
  Top 0.406: v52.67,44.7 51.97,44.7 49.73,46.94 49.73,71.25 v50.01,71.53
  Bottom 0.406: C3.+ 7.12,77.39 13.27,71.25 26.12,71.25 27.24,72.36 27.94,72.36 R28.2 28.08,72.5 29.62,74.04 44.14,74.04 46.66,71.53 v50.01,71.53 | v52.67,44.7 60.91,36.46 60.91,31.85 IC4.1
N$36
  Bottom 0.406: R29.1 68.45,77.53 67.47,77.53 64.82,80.19 41.91,80.19 41.77,80.05 13.27,80.05 10.76,77.53 C3.-
N$37
  Top 0.406: IC4.6 73.62,31.85 73.62,34.65 69.71,38.56 69.71,42.05 C4.1 65.94,45.82 65.94,47.36 62.03,51.27 62.03,57.84 61.47,58.39 61.47,75.44 | 61.47,75.44 76.69,75.44 78.65,77.39 R29.2 | 61.47,75.44 59.51,75.44 57.56,77.39 55.88,77.39 R30.1
N$38  (via drill 0.35)
  Top 0.406: v49.45,83.68 43.31,77.53 R31.1
  Bottom 0.406: 75.44,33.67 76.14,32.97 76.14,31.85 IC4.7 | 75.44,33.67 72.64,36.46 72.64,39.95 71.25,41.35 71.25,45.68 C4.2 | v49.45,83.68 57.42,83.68 58.39,82.7 64.68,82.7 65.66,83.68 69.01,83.68 69.71,82.98 69.71,77.11 69.01,76.42 | 69.01,76.42 67.06,76.42 66.08,77.39 R30.2 | 75.44,33.67 83.96,42.19 83.96,60.63 69.15,75.44 69.15,76.28 69.01,76.42
N$39  (via drill 0.35)
  Top 0.406: v77.53,55.88 v77.53,48.06 | v57.84,68.73 57.84,69.85 57,70.69 57,73.76 53.36,77.39 R31.2
  Bottom 0.406: v77.53,48.06 73.76,44.29 73.76,39.4 IC4.9 | v77.53,55.88 77.25,55.88 66.92,66.22 60.35,66.22 v57.84,68.73 | R32.1 30.59,77.53 39.26,77.53 40.23,78.51 52.25,78.51 53.23,77.53 R31.2
N$40  (via drill 0.35)
  Top 0.406: v77.39,29.62 77.39,38.14 76.28,39.26 IC4.8
  Bottom 0.406: R32.2 40.65,77.39 42.89,75.16 57.56,75.16 60.07,72.64 64.82,72.64 65.66,73.48 66.5,73.48 67.47,72.5 67.47,69.99 83.4,54.06 83.4,48.06 82.14,46.8 78.37,46.8 76.28,44.7 76.28,39.4 IC4.8 | v77.39,29.62 77.39,6.43 75.86,4.89 15.65,4.89 14.11,6.43 14.11,8.94 14.67,9.5 15.93,9.5 17.74,7.68 V_OUT.2
N$41
  Top 0.61: 22.91,82.56 17.88,82.56 R38.1 | 22.91,82.56 27.94,87.59 R43.2 | R20.1 55.88,63.84 54.48,62.45 54.48,58.53 53.23,57.28 R11.2 | 27.38,68.45 21.23,62.31 17.88,62.31 R18.1 | 27.38,68.45 29.34,68.45 R22.1 | R6.1 43.17,52.11 41.21,54.06 41.21,54.9 39.39,56.72 39.39,63.42 43.17,67.2 R21.1 43.17,67.61 40.65,70.13 40.65,72.36 R27.2 | 22.91,82.56 23.05,82.28 23.05,72.92 27.24,68.73 27.38,68.45 | IC4.10 71.11,39.4 71.11,43.17 64.82,49.45 64.82,52.53 65.52,53.23 66.5,53.23 67.61,52.11 68.45,52.11 R4.1 | IC6.10 30.45,39.26 30.45,31.85 IC6.5 30.73,31.71 32.55,29.9 35.06,29.9 41.21,23.75 45.54,23.75 48.34,20.95 48.89,20.95 IC2.5
  Bottom 0.61: R43.2 27.94,87.59 30.45,85.08 30.45,82.56 R37.1 30.73,82.42 32.41,80.75 41.49,80.75 43.17,82.42 R36.1 44.42,81.31 66.5,81.31 67.61,82.42 68.45,82.42 R34.1 | R11.2 53.36,57.14 53.36,54.62 55.88,52.11 R5.1 | R22.1 30.59,67.34 33.39,67.34 36.88,70.83 38.98,70.83 40.51,72.36 R27.2 | R20.1 55.88,67.34 54.9,67.34 53.78,68.45 44.42,68.45 43.31,67.34 R21.1 | R4.1 68.45,51.97 68.45,45.68 67.33,44.56 67.33,38.28 71.11,34.51 71.11,31.85 IC4.5 70.97,31.57 70.97,28.78 69.99,27.8 69.99,9.64 | IC6.10 30.45,39.4 30.45,45.68 R2.1 30.31,45.96 29.34,46.94 21.23,46.94 16.62,51.55 16.62,57.7 17.74,58.81 17.74,62.17 R18.1 | IC2.10 50.85,26.54 50.85,19.14 IC2.5 50.99,18.86 50.99,16.62 57.7,9.92 57.84,9.64 | 57.84,9.64 55.88,7.68 POWER.2 | 57.84,9.64 63.98,9.64 65.94,7.68 POWER2.2 66.22,7.82 68.03,9.64 69.99,9.64 | POWER1.2 74.18,9.64 69.99,9.64
N$42
  Top 0.406: IC3.3 25.42,19 25.42,17.74 35.48,7.68 V_IN2.1
N$43
  Top 0.406: IC3.5 30.59,19 30.59,15.09 38,7.68 V_IN2.2
N$44  (via drill 0.35)
  Top 0.406: v44.7,59.79 47.5,57 47.5,55.74 44.7,52.95 44.7,38.7 43.31,37.3 43.31,31.85 IC5.2 | v63.42,63.14 65.38,63.14 68.45,66.22 69.01,66.22 79.77,76.97 79.77,81.45 78.79,82.42 R34.2
  Bottom 0.406: v44.7,59.79 44.98,59.79 48.48,63.28 63.28,63.28 v63.42,63.14 | R33.1 17.74,77.39 12.29,77.39 11.18,76.28 10.2,76.28 9.5,76.97 9.5,80.89 20.26,91.64 38,91.64 40.65,94.3 69.29,94.3 78.65,84.94 78.65,82.56 R34.2
N$45
  Top 0.406: R33.2 27.94,76.42 36.04,68.31 36.04,41.07 41.21,35.9 41.21,32.41 40.65,31.85 IC5.1
  Bottom 0.406: IC5.1 40.65,31.85 41.07,31.85 46.8,37.58 49.03,37.58 50.71,39.26 IC5.10
N$46  (via drill 0.35)
  Top 0.406: v57.7,41.63 57.7,38.98 56.3,37.58 55.46,37.58 53.78,39.26 53.36,39.26 IC5.9 | v63.7,41.63 64.96,41.63 v65.38,41.21 | v67.33,62.45 67.33,63.7 80.33,76.7 80.33,82.42 75.16,87.59 68.59,87.59 R39.1
  Bottom 0.406: v63.7,41.63 v57.7,41.63 | v65.38,41.21 65.38,43.59 67.33,45.54 v67.33,62.45 | R37.2 40.51,82.56 40.51,86.2 39.53,87.17 39.53,88.01 42.33,90.81 65.66,90.81 67.47,92.62 67.47,93.18 68.03,93.74 69.01,93.74 69.71,93.04 69.71,88.85 68.59,87.73 R39.1
N$47
  Top 0.406: IC5.6 53.23,31.85 53.23,37.3 51.83,38.7 51.83,43.17 48.62,46.38 48.62,77.81 53.23,82.42 R36.2 53.5,82.56 55.88,82.56 R35.1
N$48  (via drill 0.35)
  Top 0.406: v59.79,76.28 65.94,82.42 R35.2 | v59.79,74.04 59.79,54.48 52.95,47.64 v51.83,47.64
  Bottom 0.406: IC5.7 55.88,37.16 54.48,38.56 54.48,40.37 52.95,41.91 51.83,41.91 | 51.83,41.91 48.34,41.91 45.82,39.4 IC5.12 | v59.79,74.04 v59.79,76.28 | 51.83,41.91 v51.83,47.64
N$49  (via drill 0.35)
  Top 0.406: v51.13,48.34 54.76,51.97 54.76,54.48 58.67,58.39 58.67,69.85 57.56,70.97 57.56,74.32 54.76,77.11 54.76,78.23 58.67,82.14 v58.67,83.54 | R38.2 27.94,82.56 28.92,82.56 35.9,89.55 54.06,89.55 55.88,87.73 R40.1
  Bottom 0.406: v51.13,48.34 43.31,40.51 43.31,39.4 IC5.13 | v58.67,83.54 58.67,84.8 55.88,87.59 R40.1
N$50  (via drill 0.35)
  Top 0.406: v29.2,77.25 36.6,69.85 36.6,48.2 40.51,44.29 40.51,39.4 IC5.14 | 26.26,81.45 26.26,83.4 30.45,87.59 R42.1 | 26.26,81.45 v26.26,79.21 | v43.87,88.71 38.14,88.71 30.87,81.45 26.26,81.45
  Bottom 0.406: v29.2,77.25 29.2,77.67 27.66,79.21 v26.26,79.21 | v43.87,88.71 56.3,88.71 57.28,87.73 65.94,87.73 R40.2
N$51
  Top 0.406: 56.44,86.61 52.81,86.61 51.83,87.59 43.31,87.59 R41.1 | 56.44,86.61 60.91,91.08 60.91,92.48 62.17,93.74 72.64,93.74 78.65,87.73 R39.2 | IC5.8 55.88,39.95 49.17,46.66 49.17,75.72 54.9,81.45 56.3,81.45 57,82.14 57,86.06 56.44,86.61
N$52
  Top 0.406: IC6.2 22.77,31.85 22.77,37.3 21.37,38.7 21.37,57.14 16.76,61.75 16.76,82.98 22.49,88.71 28.36,88.71 29.06,88.01 29.06,87.03 25.42,83.4 25.42,78.93 25.98,78.37 26.54,78.37 29.06,80.89 33.81,80.89 40.51,87.59 R42.2
  Bottom 0.406: R44.1 68.45,92.62 65.38,89.55 42.47,89.55 40.65,87.73 R42.2
N$53  (via drill 0.35)
  Top 0.406: v15.93,63.84 15.93,85.78 R43.1
  Bottom 0.406: v15.93,63.84 15.93,51.27 18.86,48.34 18.86,38.7 25.29,32.27 25.29,31.85 IC6.3 | R43.1 18.86,88.71 30.87,88.71 38.14,81.45 41.07,81.45 41.77,82.14 41.77,82.7 46.66,87.59 53.23,87.59 R41.2
N$54
  Top 0.406: IC6.1 20.26,31.85 20.26,37.3 13.97,43.59 13.97,61.05 8.38,66.64 8.38,87.59 7.12,88.85 C5.+ 7.68,88.57 13.41,94.3 72.92,94.3 74.46,92.76 78.65,92.76 R44.2
N$55
  Top 0.406: C5.- 11.87,90.11 52.25,90.11 54.76,92.62 55.88,92.62 R45.1
N$56  (via drill 0.35)
  Top 0.406: v40.37,34.37 36.04,34.37 33.53,31.85 33.11,31.85 IC6.6 | v56.02,46.8 v50.99,46.8 | v60.63,78.23 60.63,83.68 65.94,88.99 65.94,92.62 R45.2 | v60.63,73.48 60.63,52.53 58.53,50.43 58.53,45.82 C6.1
  Bottom 0.406: R46.1 43.31,92.62 51.97,92.62 53.23,91.36 64.68,91.36 65.94,92.62 R45.2 | v40.37,34.37 44.7,38.7 44.7,40.51 v50.99,46.8 | v56.02,46.8 56.3,46.8 57.28,45.82 58.39,45.82 C6.1 | v60.63,73.48 v60.63,78.23
N$57  (via drill 0.35)
  Top 0.406: R47.1 30.59,92.76 39.12,92.76 40.09,93.74 52.25,93.74 53.23,92.76 R46.2 | v41.77,56.44 42.33,56.44 42.75,56.02 v46.66,56.02 | v61.75,92.2 61.75,87.73 57.56,83.54 57.56,81.86 54.2,78.51 52.81,78.51 51.27,76.97 51.27,71.95 51.41,71.81 v51.41,57.84
  Bottom 0.406: v41.77,56.44 34.51,49.17 34.51,38.28 35.48,37.3 35.48,31.85 IC6.7 | 49.87,56.02 v46.66,56.02 | 49.87,56.02 52.25,53.64 52.25,51.69 57.14,46.8 62.45,46.8 63.42,45.82 C6.2 | v61.75,92.2 60.21,93.74 55.46,93.74 54.48,92.76 53.36,92.76 R46.2 | v51.41,57.84 51.41,57.56 49.87,56.02
N$58  (via drill 0.35)
  Top 0.406: R47.2 40.51,92.62 39.53,91.64 27.52,91.64 26.54,92.62 17.88,92.62 R48.1 17.6,92.62 12.71,92.62 9.5,89.41 9.5,88.43 11.87,86.06 11.87,65.8 18.58,59.09 v18.58,58.81 | v24.59,52.95 24.59,47.5 32.69,39.4 32.97,39.4 IC6.9
  Bottom 0.406: v24.59,52.95 18.72,58.81 v18.58,58.81
N$59
  Bottom 0.406: 23.05,10.34 26.54,10.34 34.09,17.88 34.09,19.7 36.6,22.21 36.6,37.02 35.62,38 35.62,39.26 IC6.8 | 23.05,10.34 20.4,7.68 V_OUT.3 | 23.05,10.34 5.87,27.52 5.87,78.09 20.4,92.62 27.94,92.62 R48.2
N$60  (via drill 0.35)
  Top 0.508: v43.03,21.51 37.44,21.51 35.62,23.33 31.57,23.33 28.36,26.54 27.94,26.54 IC3.11 | 72.08,25.43 72.22,25.56 72.22,35.06 68.59,38.7 68.59,39.26 IC4.11 | 72.08,25.43 71.53,24.87 70.69,24.87 69.01,26.54 68.59,26.54 IC1.11 | 72.08,25.43 78.65,18.86 78.65,7.82 POWER1.3 78.65,7.54 76.69,5.59 70.55,5.59 68.73,7.4 POWER2.3 68.45,7.68 66.5,9.64 63,9.64 61.05,7.68 58.53,7.68 POWER.3 58.39,7.82 v56.58,9.64
  Bottom 0.508: IC3.11 27.94,29.48 26.82,30.59 26.82,38.14 27.94,39.26 IC6.11 | IC2.11 48.2,26.68 48.2,29.62 47.08,30.73 47.08,33.39 51.97,38.28 51.97,40.37 51.13,41.21 50.15,41.21 48.34,39.4 IC5.11 | v43.03,21.51 48.06,26.54 IC2.11 | v56.58,9.64 49.73,16.48 49.73,24.59 48.06,26.26 IC2.11
N$61
  Bottom 0.406: IC5.3 45.68,31.71 45.68,28.78 44.28,27.38 44.28,24.87 38.14,18.72 38.14,17.74 29.9,9.5 28.5,9.5 26.68,7.68 V_IN3.1
N$62  (via drill 0.35)
  Top 0.406: v43.59,29.2 47.92,29.2 50.43,31.71 50.71,31.71 IC5.5 | v25.84,9.5 27.38,9.5 29.2,7.68 V_IN3.2
  Bottom 0.406: v43.59,29.2 41.77,27.38 41.77,23.19 37.58,19 37.58,18.02 29.62,10.06 27.1,10.06 26.54,9.5 v25.84,9.5